# EAGLE board BMS Practice Board (EAGLE 9.2.2)
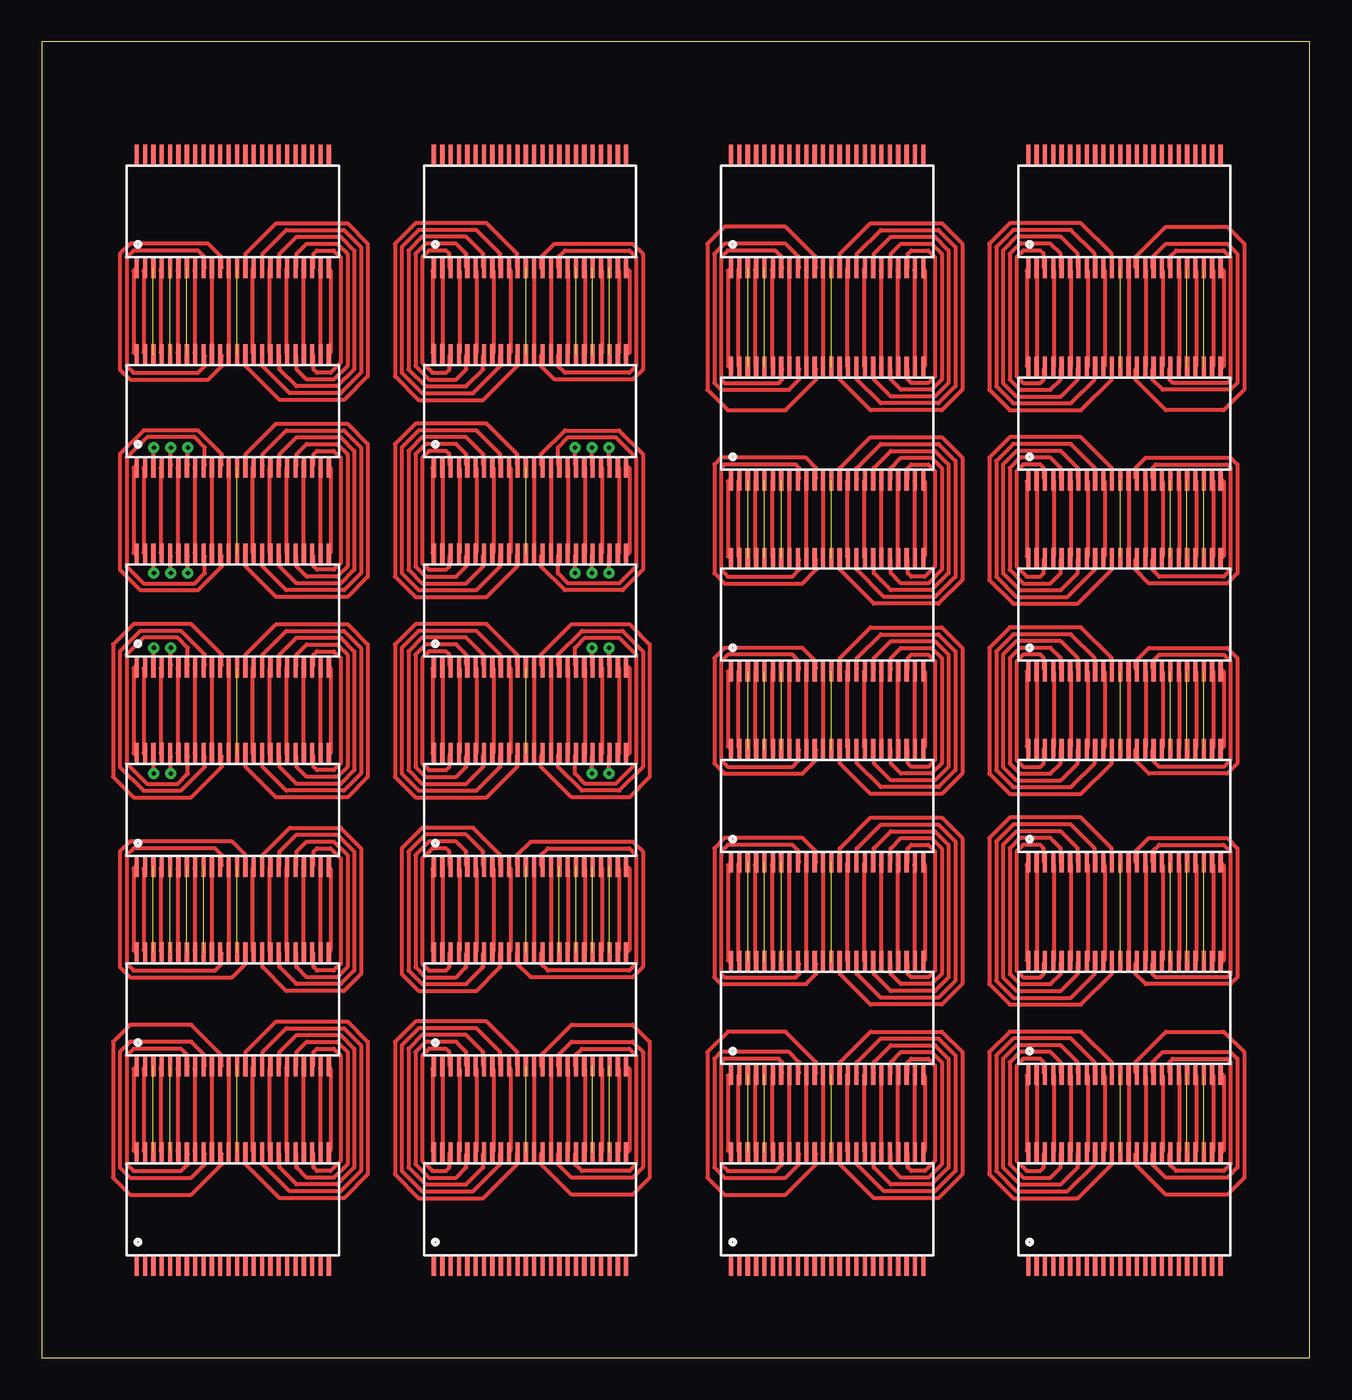
[diagram p1: board, top side]
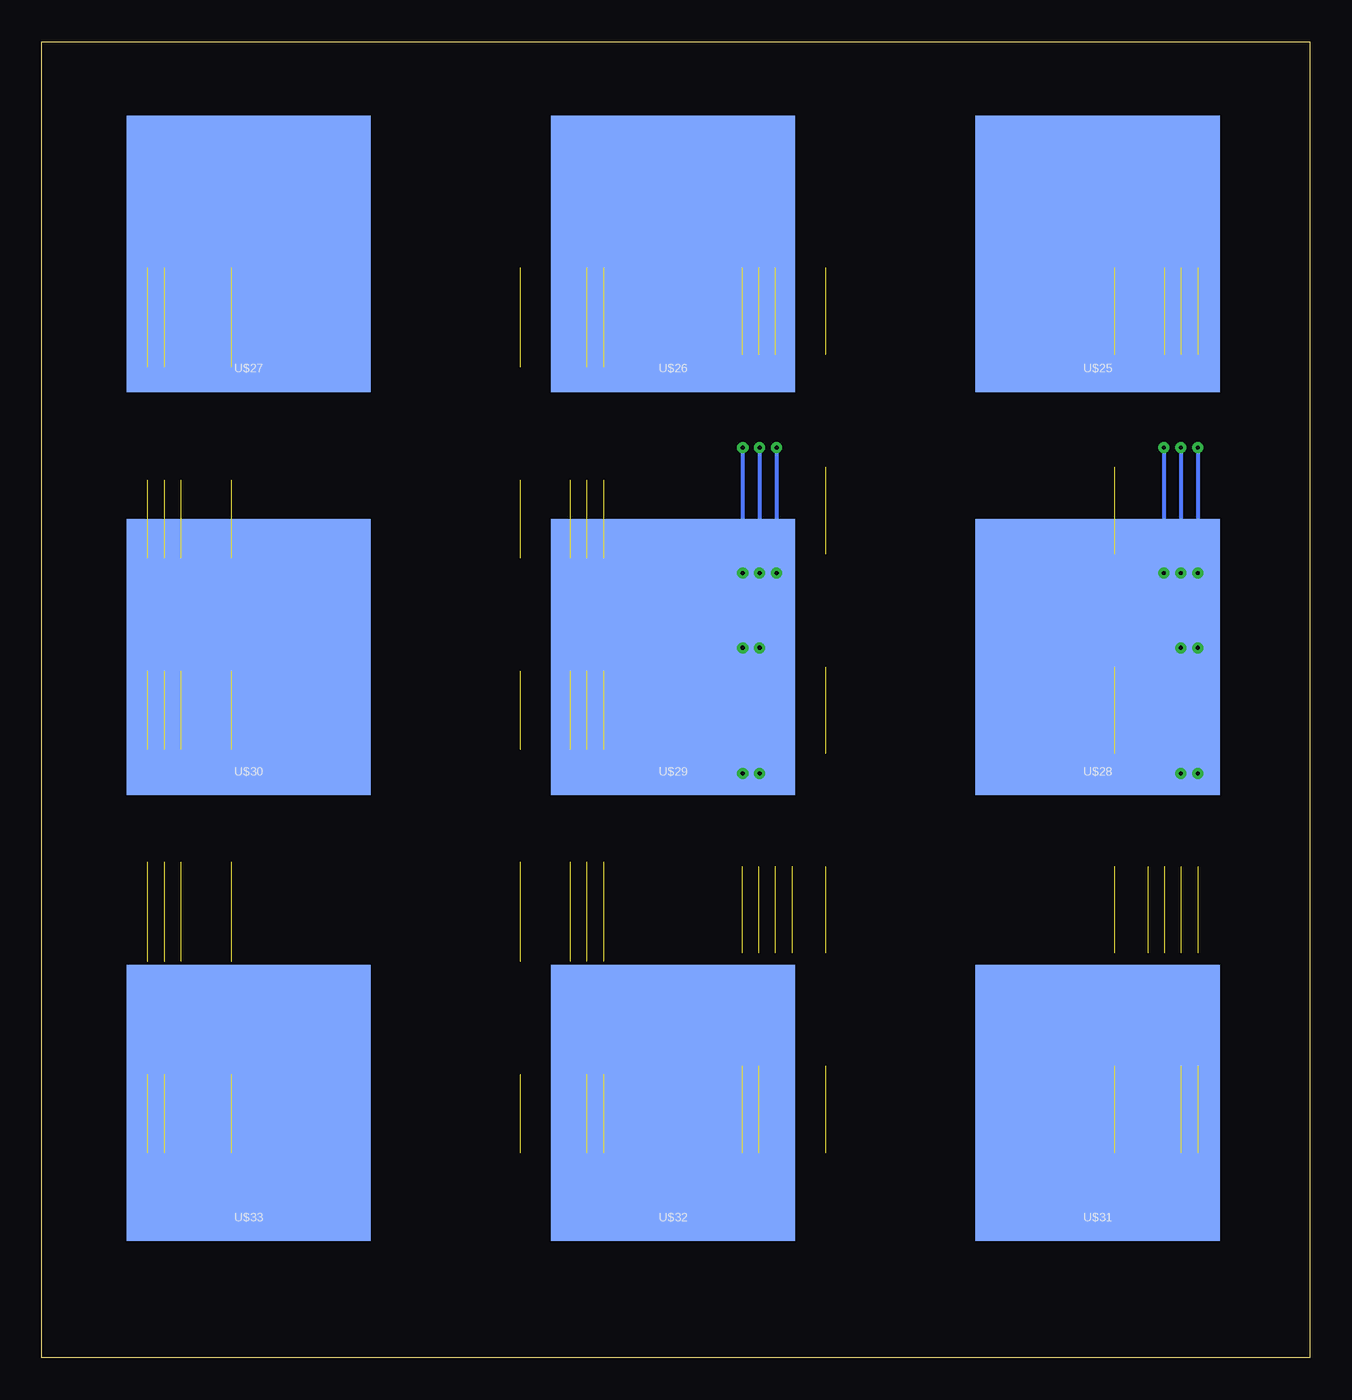
[diagram p2: board, bottom side, seen from below]

Size 75.87 x 78.73 mm. Coordinates in mm from the lower left corner, seen from the top.
Outline: 0,0 75.87,0 75.87,78.73 0,78.73 0,0
Copper layers (1*16): Top 0.035mm / dielectric 1.5mm / Bottom 0.035mm
Design rules "DRC Advanced Circuits": minimum track width 6mil, minimum drill 10mil, track to track 6mil, track to pad 6mil, pad to pad 6mil, via to via 6mil, smd to smd 6mil, copper to edge 40mil, drill to drill 6mil, minimum pad ring 10mil, minimum via ring 8mil, stop-mask expansion 4mil, vias tented up to drill 0mil, thermal gap 10mil
Net classes: 0 default: width 0.254 mm

## Footprints (pad centres in the part's own frame; a part is rotated, then mirrored left to right if it is on the bottom)
LTC6804 = smd 0.25 x 1.25: 1 -5.75,-3.37; 2 -5.25,-3.37; 3 -4.75,-3.37; 4 -4.25,-3.37; 5 -3.75,-3.37; 6 -3.25,-3.37; 7 -2.75,-3.37; 8 -2.25,-3.37; 9 -1.75,-3.37; 10 -1.25,-3.37; 11 -0.75,-3.37; 12 -0.25,-3.37; 13 0.25,-3.37; 14 0.75,-3.37; 15 1.25,-3.37; 16 1.75,-3.37; 17 2.25,-3.37; 18 2.75,-3.37; 19 3.25,-3.37; 20 3.75,-3.37; 21 4.25,-3.37; 22 4.75,-3.37; 23 5.25,-3.37; 24 5.75,-3.37; 25 5.75,3.38; 26 5.25,3.38; 27 4.75,3.38; 28 4.25,3.38; 29 3.75,3.38; 30 3.25,3.38; 31 2.75,3.38; 32 2.25,3.38; 33 1.75,3.38; 34 1.25,3.38; 35 0.75,3.38; 36 0.25,3.38; 37 -0.25,3.38; 38 -0.75,3.38; 39 -1.25,3.38; 40 -1.75,3.38; 41 -2.25,3.38; 42 -2.75,3.38; 43 -3.25,3.38; 44 -3.75,3.38; 45 -4.25,3.38; 46 -4.75,3.38; 47 -5.25,3.38; 48 -5.75,3.38
KEYSTONE5222 = smd 14.605 x 16.51: P$1 0,0

## Placement (x,y rotation side)
U$1  LTC6804-2  [LTC6804]  11.43,8.89 0 top
U$2  LTC6804-2  [LTC6804]  11.43,20.83 0 top
U$3  LTC6804-2  [LTC6804]  11.43,32.77 0 top
U$4  LTC6804-2  [LTC6804]  11.43,44.7 0 top
U$5  LTC6804-2  [LTC6804]  11.43,56.64 0 top
U$6  LTC6804-2  [LTC6804]  11.43,68.58 0 top
U$7  LTC6804-2  [LTC6804]  29.21,8.89 0 top
U$8  LTC6804-2  [LTC6804]  29.21,20.83 0 top
U$9  LTC6804-2  [LTC6804]  29.21,32.77 0 top
U$10  LTC6804-2  [LTC6804]  29.21,44.7 0 top
U$11  LTC6804-2  [LTC6804]  29.21,56.64 0 top
U$12  LTC6804-2  [LTC6804]  29.21,68.58 0 top
U$13  LTC6804-2  [LTC6804]  46.99,8.89 0 top
U$14  LTC6804-2  [LTC6804]  46.99,20.32 0 top
U$15  LTC6804-2  [LTC6804]  46.99,33.02 0 top
U$16  LTC6804-2  [LTC6804]  46.99,44.45 0 top
U$17  LTC6804-2  [LTC6804]  46.99,55.88 0 top
U$18  LTC6804-2  [LTC6804]  46.99,68.58 0 top
U$19  LTC6804-2  [LTC6804]  64.77,8.89 0 top
U$20  LTC6804-2  [LTC6804]  64.77,20.32 0 top
U$21  LTC6804-2  [LTC6804]  64.77,33.02 0 top
U$22  LTC6804-2  [LTC6804]  64.77,44.45 0 top
U$23  LTC6804-2  [LTC6804]  64.77,55.88 0 top
U$24  LTC6804-2  [LTC6804]  64.77,68.58 0 top
U$25  BATTERY_SPRING_KEYSTONE5222  [KEYSTONE5222]  12.7,66.04 0 bottom
U$26  BATTERY_SPRING_KEYSTONE5222  [KEYSTONE5222]  38.1,66.04 0 bottom
U$27  BATTERY_SPRING_KEYSTONE5222  [KEYSTONE5222]  63.5,66.04 0 bottom
U$28  BATTERY_SPRING_KEYSTONE5222  [KEYSTONE5222]  12.7,41.91 0 bottom
U$29  BATTERY_SPRING_KEYSTONE5222  [KEYSTONE5222]  38.1,41.91 0 bottom
U$30  BATTERY_SPRING_KEYSTONE5222  [KEYSTONE5222]  63.5,41.91 0 bottom
U$31  BATTERY_SPRING_KEYSTONE5222  [KEYSTONE5222]  12.7,15.24 0 bottom
U$32  BATTERY_SPRING_KEYSTONE5222  [KEYSTONE5222]  38.1,15.24 0 bottom
U$33  BATTERY_SPRING_KEYSTONE5222  [KEYSTONE5222]  63.5,15.24 0 bottom

## Tracks (layer width: path | path; a pad name or v marks a point on that pad's centre or on a via)
N$1
  Top 0.254: U$1.48 5.69,12.19 5.49,12.39 5.49,17.27 5.69,17.48 U$2.1
N$2
  Top 0.254: U$1.47 6.1,12.39 6.1,17.27 U$2.2
N$3  (1 unrouted)
N$4
  Top 0.254: U$1.45 7.11,12.39 7.11,17.27 U$2.4
N$5  (1 unrouted)
N$6
  Top 0.254: U$1.43 8.13,12.39 8.13,17.27 U$2.6
N$7
  Top 0.254: U$1.42 8.74,12.19 8.74,11.58 8.33,11.18 5.49,11.18 5.08,11.58 5.08,18.09 5.49,18.49 8.33,18.49 8.74,18.09 8.74,17.48 U$2.7
N$8
  Top 0.254: U$1.41 9.14,12.39 9.14,17.27 U$2.8
N$9
  Top 0.254: U$1.40 9.75,12.19 9.75,11.58 8.94,10.77 5.28,10.77 4.67,11.38 4.67,18.29 5.28,18.9 8.94,18.9 9.75,18.09 9.75,17.48 U$2.9
N$10
  Top 0.254: U$1.39 10.16,12.39 10.16,17.27 U$2.10
N$11
  Top 0.254: U$1.38 10.77,12.19 10.77,11.58 8.94,9.75 5.28,9.75 4.27,10.77 4.27,18.9 5.28,19.91 8.94,19.91 10.77,18.09 10.77,17.48 U$2.11
N$12
  Top 0.254: U$1.37 11.18,12.39 11.18,17.27 U$2.12
N$13  (1 unrouted)
N$14
  Top 0.254: U$1.35 12.19,12.19 12.19,11.58 14.22,9.55 18.09,9.55 19.51,10.97 19.51,18.9 18.29,20.12 14.02,20.12 12.19,18.29 12.19,17.48 U$2.14
N$15
  Top 0.254: U$1.34 12.6,12.39 12.6,17.27 U$2.15
N$16
  Top 0.254: U$1.33 13.21,12.19 13.21,11.58 14.83,9.96 17.88,9.96 19.1,11.18 19.1,18.69 18.09,19.71 14.63,19.71 13.21,18.29 13.21,17.48 U$2.16
N$17
  Top 0.254: U$1.32 13.61,12.39 13.61,17.27 U$2.17
N$18
  Top 0.254: U$1.31 14.22,12.19 14.22,11.38 15.24,10.36 17.68,10.36 18.69,11.38 18.69,18.49 17.88,19.3 15.24,19.3 14.22,18.29 14.22,17.48 U$2.18
N$19
  Top 0.254: U$1.30 14.63,12.39 14.63,17.27 U$2.19
N$20
  Top 0.254: U$1.29 15.24,12.19 15.24,11.38 15.85,10.77 17.48,10.77 18.29,11.58 18.29,18.29 17.68,18.9 15.85,18.9 15.24,18.29 15.24,17.48 U$2.20
N$21
  Top 0.254: U$1.28 15.65,12.39 15.65,17.27 U$2.21
N$22
  Top 0.254: U$1.27 16.26,12.19 16.26,11.38 16.46,11.18 17.27,11.18 17.88,11.79 17.88,18.09 17.48,18.49 16.46,18.49 16.26,18.29 16.26,17.48 U$2.22
N$23
  Top 0.254: U$1.26 16.66,12.39 16.66,17.27 U$2.23
N$24
  Top 0.254: U$1.25 17.27,12.39 17.27,17.27 U$2.24
N$25
  Top 0.254: U$2.48 5.69,24.18 5.49,24.38 5.49,29.26 5.69,29.46 U$3.1
N$26
  Top 0.254: U$2.47 6.1,24.38 6.1,29.26 U$3.2
N$27  (1 unrouted)
N$28
  Top 0.254: U$2.45 7.11,24.38 7.11,29.26 U$3.4
N$29  (1 unrouted)
N$30
  Top 0.254: U$2.43 8.13,24.38 8.13,29.26 U$3.6
N$31  (1 unrouted)
N$32
  Top 0.254: U$2.41 9.14,24.38 9.14,29.26 U$3.8
N$33  (1 unrouted)
N$34
  Top 0.254: U$2.39 10.16,24.38 10.16,29.26 U$3.10
N$35
  Top 0.254: U$2.38 10.77,24.18 10.77,23.57 10.36,23.16 5.49,23.16 5.08,23.57 5.08,30.07 5.49,30.48 10.36,30.48 10.77,30.07 10.77,29.46 U$3.11
N$36
  Top 0.254: U$2.37 11.18,24.38 11.18,29.26 U$3.12
N$37  (1 unrouted)
N$38
  Top 0.254: U$2.35 12.19,24.18 12.19,23.57 11.38,22.76 5.28,22.76 4.67,23.37 4.67,30.28 5.28,30.89 11.38,30.89 12.19,30.07 12.19,29.46 U$3.14
N$39
  Top 0.254: U$2.34 12.6,24.38 12.6,29.26 U$3.15
N$40
  Top 0.254: U$2.33 13.21,24.18 13.21,23.37 14.63,21.95 18.09,21.95 19.1,22.96 19.1,30.48 17.88,31.7 14.83,31.7 13.21,30.07 13.21,29.46 U$3.16
N$41
  Top 0.254: U$2.32 13.61,24.38 13.61,29.26 U$3.17
N$42
  Top 0.254: U$2.31 14.22,24.18 14.22,23.37 15.24,22.35 17.88,22.35 18.69,23.16 18.69,30.28 17.68,31.29 15.24,31.29 14.22,30.28 14.22,29.46 U$3.18
N$43
  Top 0.254: U$2.30 14.63,24.38 14.63,29.26 U$3.19
N$44
  Top 0.254: U$2.29 15.24,24.18 15.24,23.37 15.85,22.76 17.68,22.76 18.29,23.37 18.29,30.07 17.48,30.89 15.85,30.89 15.24,30.28 15.24,29.46 U$3.20
N$45
  Top 0.254: U$2.28 15.65,24.38 15.65,29.26 U$3.21
N$46
  Top 0.254: U$2.27 16.26,24.18 16.26,23.37 16.46,23.16 17.48,23.16 17.88,23.57 17.88,29.87 17.27,30.48 16.46,30.48 16.26,30.28 16.26,29.46 U$3.22
N$47
  Top 0.254: U$2.26 16.66,24.38 16.66,29.26 U$3.23
N$48
  Top 0.254: U$2.25 17.27,24.38 17.27,29.26 U$3.24
N$49
  Top 0.254: U$3.48 5.69,35.97 5.49,36.17 5.49,41.25 5.69,41.45 U$4.1
N$50
  Top 0.254: U$3.47 6.1,36.17 6.1,41.25 U$4.2
N$51  (via drill 0.25)
  Top 0.254: v6.71,34.95 6.71,35.97 U$3.46 | v6.71,42.47 6.71,41.45 U$4.3
  Bottom 0.254: v6.71,42.47 v6.71,34.95
N$52
  Top 0.254: U$3.45 7.11,36.17 7.11,41.25 U$4.4
N$53  (via drill 0.25)
  Top 0.254: v7.72,34.95 7.72,35.97 U$3.44 | v7.72,42.47 7.72,41.45 U$4.5
  Bottom 0.254: v7.72,42.47 v7.72,34.95
N$54
  Top 0.254: U$3.43 8.13,36.17 8.13,41.25 U$4.6
N$55
  Top 0.254: U$3.42 8.74,35.97 8.74,34.95 8.13,34.34 6.3,34.34 5.08,35.56 5.08,42.06 6.1,43.08 8.13,43.08 8.74,42.47 8.74,41.45 U$4.7
N$56
  Top 0.254: U$3.41 9.14,36.17 9.14,41.25 U$4.8
N$57
  Top 0.254: U$3.40 9.75,35.97 9.75,35.36 8.33,33.93 6.1,33.93 4.67,35.36 4.67,42.27 5.89,43.48 8.33,43.48 9.75,42.06 9.75,41.45 U$4.9
N$58
  Top 0.254: U$3.39 10.16,36.17 10.16,41.25 U$4.10
N$59
  Top 0.254: U$3.38 10.77,35.97 10.77,35.36 8.94,33.53 5.49,33.53 4.27,34.75 4.27,42.67 5.49,43.89 8.94,43.89 10.77,42.06 10.77,41.45 U$4.11
N$60
  Top 0.254: U$3.37 11.18,36.17 11.18,41.25 U$4.12
N$61  (1 unrouted)
N$62
  Top 0.254: U$3.35 12.19,35.97 12.19,35.36 14.02,33.53 18.29,33.53 19.51,34.75 19.51,42.67 18.29,43.89 14.02,43.89 12.19,42.06 12.19,41.45 U$4.14
N$63
  Top 0.254: U$3.34 12.6,36.17 12.6,41.25 U$4.15
N$64
  Top 0.254: U$3.33 13.21,35.97 13.21,35.36 14.63,33.93 18.09,33.93 19.1,34.95 19.1,42.47 18.09,43.48 14.63,43.48 13.21,42.06 13.21,41.45 U$4.16
N$65
  Top 0.254: U$3.32 13.61,36.17 13.61,41.25 U$4.17
N$66
  Top 0.254: U$3.31 14.22,35.97 14.22,35.36 15.24,34.34 17.88,34.34 18.69,35.15 18.69,42.27 17.88,43.08 15.24,43.08 14.22,42.06 14.22,41.45 U$4.18
N$67
  Top 0.254: U$3.30 14.63,36.17 14.63,41.25 U$4.19
N$68
  Top 0.254: U$3.29 15.24,35.97 15.24,35.36 15.85,34.75 17.68,34.75 18.29,35.36 18.29,42.06 17.68,42.67 15.85,42.67 15.24,42.06 15.24,41.45 U$4.20
N$69
  Top 0.254: U$3.28 15.65,36.17 15.65,41.25 U$4.21
N$70
  Top 0.254: U$3.27 16.26,35.97 16.26,35.36 16.46,35.15 17.48,35.15 17.88,35.56 17.88,41.86 17.48,42.27 16.46,42.27 16.26,42.06 16.26,41.45 U$4.22
N$71
  Top 0.254: U$3.26 16.66,36.17 16.66,41.25 U$4.23
N$72
  Top 0.254: U$3.25 17.27,36.17 17.27,41.25 U$4.24
N$73
  Top 0.254: U$4.48 5.69,47.95 5.49,48.16 5.49,53.24 5.69,53.44 U$5.1
N$74
  Top 0.254: U$4.47 6.1,48.16 6.1,53.24 U$5.2
N$75  (via drill 0.25)
  Top 0.254: v6.71,46.94 6.71,47.95 U$4.46 | v6.71,54.46 6.71,53.44 U$5.3
  Bottom 0.254: v6.71,54.46 v6.71,46.94
N$76
  Top 0.254: U$4.45 7.11,48.16 7.11,53.24 U$5.4
N$77  (via drill 0.25)
  Top 0.254: v7.72,46.94 7.72,47.95 U$4.44 | v7.72,54.46 7.72,53.44 U$5.5
  Bottom 0.254: v7.72,54.46 v7.72,46.94
N$78
  Top 0.254: U$4.43 8.13,48.16 8.13,53.24 U$5.6
N$79  (via drill 0.25)
  Top 0.254: v8.74,46.94 8.74,47.95 U$4.42 | v8.74,54.46 8.74,53.44 U$5.7
  Bottom 0.254: v8.74,54.46 v8.74,46.94
N$80
  Top 0.254: U$4.41 9.14,48.16 9.14,53.24 U$5.8
N$81
  Top 0.254: U$4.40 9.75,47.95 9.75,46.94 9.14,46.33 6.1,46.33 5.08,47.35 5.08,53.85 6.3,55.07 9.14,55.07 9.75,54.46 9.75,53.44 U$5.9
N$82
  Top 0.254: U$4.39 10.16,48.16 10.16,53.24 U$5.10
N$83
  Top 0.254: U$4.38 10.77,47.95 10.77,47.35 9.35,45.92 5.89,45.92 4.67,47.14 4.67,54.05 6.1,55.47 9.35,55.47 10.77,54.05 10.77,53.44 U$5.11
N$84
  Top 0.254: U$4.37 11.18,48.16 11.18,53.24 U$5.12
N$85  (1 unrouted)
N$86
  Top 0.254: U$4.35 12.19,47.95 12.19,47.35 14.02,45.52 18.29,45.52 19.51,46.74 19.51,54.66 18.29,55.88 14.02,55.88 12.19,54.05 12.19,53.44 U$5.14
N$87
  Top 0.254: U$4.34 12.6,48.16 12.6,53.24 U$5.15
N$88
  Top 0.254: U$4.33 13.21,47.95 13.21,47.35 14.63,45.92 18.09,45.92 19.1,46.94 19.1,54.46 18.09,55.47 14.63,55.47 13.21,54.05 13.21,53.44 U$5.16
N$89
  Top 0.254: U$4.32 13.61,48.16 13.61,53.24 U$5.17
N$90
  Top 0.254: U$4.31 14.22,47.95 14.22,47.35 15.24,46.33 17.88,46.33 18.69,47.14 18.69,54.25 17.88,55.07 15.24,55.07 14.22,54.05 14.22,53.44 U$5.18
N$91
  Top 0.254: U$4.30 14.63,48.16 14.63,53.24 U$5.19
N$92
  Top 0.254: U$4.29 15.24,47.95 15.24,47.35 15.85,46.74 17.68,46.74 18.29,47.35 18.29,54.05 17.68,54.66 15.85,54.66 15.24,54.05 15.24,53.44 U$5.20
N$93
  Top 0.254: U$4.28 15.65,48.16 15.65,53.24 U$5.21
N$94
  Top 0.254: U$4.27 16.26,47.95 16.26,47.35 16.46,47.14 17.48,47.14 17.88,47.55 17.88,53.85 17.48,54.25 16.46,54.25 16.26,54.05 16.26,53.44 U$5.22
N$95
  Top 0.254: U$4.26 16.66,48.16 16.66,53.24 U$5.23
N$96
  Top 0.254: U$4.25 17.27,48.16 17.27,53.24 U$5.24
N$97
  Top 0.254: U$5.48 5.69,59.94 5.49,60.15 5.49,65.02 5.69,65.23 U$6.1
N$98
  Top 0.254: U$5.47 6.1,60.15 6.1,65.02 U$6.2
N$99  (1 unrouted)
N$100
  Top 0.254: U$5.45 7.11,60.15 7.11,65.02 U$6.4
N$101  (1 unrouted)
N$102
  Top 0.254: U$5.43 8.13,60.15 8.13,65.02 U$6.6
N$103  (1 unrouted)
N$104
  Top 0.254: U$5.41 9.14,60.15 9.14,65.02 U$6.8
N$105
  Top 0.254: U$5.40 9.75,59.94 9.75,59.33 9.35,58.93 5.49,58.93 5.08,59.33 5.08,65.84 5.49,66.24 9.35,66.24 9.75,65.84 9.75,65.23 U$6.9
N$106
  Top 0.254: U$5.39 10.16,60.15 10.16,65.02 U$6.10
N$107
  Top 0.254: U$5.38 10.77,59.94 10.77,59.33 9.96,58.52 5.28,58.52 4.67,59.13 4.67,66.04 5.28,66.65 9.96,66.65 10.77,65.84 10.77,65.23 U$6.11
N$108
  Top 0.254: U$5.37 11.18,60.15 11.18,65.02 U$6.12
N$109  (1 unrouted)
N$110
  Top 0.254: U$5.35 12.19,59.94 12.19,59.33 14.22,57.3 18.09,57.3 19.51,58.73 19.51,66.65 18.29,67.87 14.02,67.87 12.19,66.04 12.19,65.23 U$6.14
N$111
  Top 0.254: U$5.34 12.6,60.15 12.6,65.02 U$6.15
N$112
  Top 0.254: U$5.33 13.21,59.94 13.21,59.33 14.83,57.71 17.88,57.71 19.1,58.93 19.1,66.45 18.09,67.46 14.63,67.46 13.21,66.04 13.21,65.23 U$6.16
N$113
  Top 0.254: U$5.32 13.61,60.15 13.61,65.02 U$6.17
N$114
  Top 0.254: U$5.31 14.22,59.94 14.22,59.13 15.24,58.12 17.68,58.12 18.69,59.13 18.69,66.24 17.88,67.06 15.24,67.06 14.22,66.04 14.22,65.23 U$6.18
N$115
  Top 0.254: U$5.30 14.63,60.15 14.63,65.02 U$6.19
N$116
  Top 0.254: U$5.29 15.24,59.94 15.24,59.13 15.85,58.52 17.48,58.52 18.29,59.33 18.29,66.04 17.68,66.65 15.85,66.65 15.24,66.04 15.24,65.23 U$6.20
N$117
  Top 0.254: U$5.28 15.65,60.15 15.65,65.02 U$6.21
N$118
  Top 0.254: U$5.27 16.26,59.94 16.26,59.13 16.46,58.93 17.27,58.93 17.88,59.54 17.88,65.84 17.48,66.24 16.46,66.24 16.26,66.04 16.26,65.23 U$6.22
N$119
  Top 0.254: U$5.26 16.66,60.15 16.66,65.02 U$6.23
N$120
  Top 0.254: U$5.25 17.27,60.15 17.27,65.02 U$6.24
N$121
  Top 0.254: U$7.25 34.95,12.19 35.15,12.39 35.15,17.27 34.95,17.48 U$8.24
N$122
  Top 0.254: U$7.26 34.54,12.39 34.54,17.27 U$8.23
N$123  (1 unrouted)
N$124
  Top 0.254: U$7.28 33.53,12.39 33.53,17.27 U$8.21
N$125  (1 unrouted)
N$126
  Top 0.254: U$7.30 32.51,12.39 32.51,17.27 U$8.19
N$127
  Top 0.254: U$7.31 31.9,12.19 31.9,11.58 32.31,11.18 35.15,11.18 35.56,11.58 35.56,18.09 35.15,18.49 32.31,18.49 31.9,18.09 31.9,17.48 U$8.18
N$128
  Top 0.254: U$7.32 31.5,12.39 31.5,17.27 U$8.17
N$129
  Top 0.254: U$7.33 30.89,12.19 30.89,11.58 31.7,10.77 35.36,10.77 35.97,11.38 35.97,18.29 35.36,18.9 31.7,18.9 30.89,18.09 30.89,17.48 U$8.16
N$130
  Top 0.254: U$7.34 30.48,12.39 30.48,17.27 U$8.15
N$131
  Top 0.254: U$7.35 29.87,12.19 29.87,11.58 31.7,9.75 35.36,9.75 36.37,10.77 36.37,18.9 35.36,19.91 31.7,19.91 29.87,18.09 29.87,17.48 U$8.14
N$132
  Top 0.254: U$7.36 29.46,12.39 29.46,17.27 U$8.13
N$133  (1 unrouted)
N$134
  Top 0.254: U$7.38 28.45,12.19 28.45,11.58 26.42,9.55 22.55,9.55 21.13,10.97 21.13,18.9 22.35,20.12 26.62,20.12 28.45,18.29 28.45,17.48 U$8.11
N$135
  Top 0.254: U$7.39 28.04,12.39 28.04,17.27 U$8.10
N$136
  Top 0.254: U$7.40 27.43,12.19 27.43,11.58 25.81,9.96 22.76,9.96 21.54,11.18 21.54,18.69 22.55,19.71 26.01,19.71 27.43,18.29 27.43,17.48 U$8.9
N$137
  Top 0.254: U$7.41 27.03,12.39 27.03,17.27 U$8.8
N$138
  Top 0.254: U$7.42 26.42,12.19 26.42,11.38 25.4,10.36 22.96,10.36 21.95,11.38 21.95,18.49 22.76,19.3 25.4,19.3 26.42,18.29 26.42,17.48 U$8.7
N$139
  Top 0.254: U$7.43 26.01,12.39 26.01,17.27 U$8.6
N$140
  Top 0.254: U$7.44 25.4,12.19 25.4,11.38 24.79,10.77 23.16,10.77 22.35,11.58 22.35,18.29 22.96,18.9 24.79,18.9 25.4,18.29 25.4,17.48 U$8.5
N$141
  Top 0.254: U$7.45 24.99,12.39 24.99,17.27 U$8.4
N$142
  Top 0.254: U$7.46 24.38,12.19 24.38,11.38 24.18,11.18 23.37,11.18 22.76,11.79 22.76,18.09 23.16,18.49 24.18,18.49 24.38,18.29 24.38,17.48 U$8.3
N$143
  Top 0.254: U$7.47 23.98,12.39 23.98,17.27 U$8.2
N$144
  Top 0.254: U$7.48 23.37,12.39 23.37,17.27 U$8.1
N$145
  Top 0.254: U$8.25 34.95,24.18 35.15,24.38 35.15,29.26 34.95,29.46 U$9.24
N$146
  Top 0.254: U$8.26 34.54,24.38 34.54,29.26 U$9.23
N$147  (1 unrouted)
N$148
  Top 0.254: U$8.28 33.53,24.38 33.53,29.26 U$9.21
N$149  (1 unrouted)
N$150
  Top 0.254: U$8.30 32.51,24.38 32.51,29.26 U$9.19
N$151  (1 unrouted)
N$152
  Top 0.254: U$8.32 31.5,24.38 31.5,29.26 U$9.17
N$153  (1 unrouted)
N$154
  Top 0.254: U$8.34 30.48,24.38 30.48,29.26 U$9.15
N$155
  Top 0.254: U$8.35 29.87,24.18 29.87,23.57 30.28,23.16 35.15,23.16 35.56,23.57 35.56,30.07 35.15,30.48 30.28,30.48 29.87,30.07 29.87,29.46 U$9.14
N$156
  Top 0.254: U$8.36 29.46,24.38 29.46,29.26 U$9.13
N$157  (1 unrouted)
N$158
  Top 0.254: U$8.38 28.45,24.18 28.45,23.57 29.26,22.76 35.36,22.76 35.97,23.37 35.97,30.28 35.36,30.89 29.26,30.89 28.45,30.07 28.45,29.46 U$9.11
N$159
  Top 0.254: U$8.39 28.04,24.38 28.04,29.26 U$9.10
N$160
  Top 0.254: U$8.40 27.43,24.18 27.43,23.37 26.01,21.95 22.55,21.95 21.54,22.96 21.54,30.48 22.76,31.7 25.81,31.7 27.43,30.07 27.43,29.46 U$9.9
N$161
  Top 0.254: U$8.41 27.03,24.38 27.03,29.26 U$9.8
N$162
  Top 0.254: U$8.42 26.42,24.18 26.42,23.37 25.4,22.35 22.76,22.35 21.95,23.16 21.95,30.28 22.96,31.29 25.4,31.29 26.42,30.28 26.42,29.46 U$9.7
N$163
  Top 0.254: U$8.43 26.01,24.38 26.01,29.26 U$9.6
N$164
  Top 0.254: U$8.44 25.4,24.18 25.4,23.37 24.79,22.76 22.96,22.76 22.35,23.37 22.35,30.07 23.16,30.89 24.79,30.89 25.4,30.28 25.4,29.46 U$9.5
N$165
  Top 0.254: U$8.45 24.99,24.38 24.99,29.26 U$9.4
N$166
  Top 0.254: U$8.46 24.38,24.18 24.38,23.37 24.18,23.16 23.16,23.16 22.76,23.57 22.76,29.87 23.37,30.48 24.18,30.48 24.38,30.28 24.38,29.46 U$9.3
N$167
  Top 0.254: U$8.47 23.98,24.38 23.98,29.26 U$9.2
N$168
  Top 0.254: U$8.48 23.37,24.38 23.37,29.26 U$9.1
N$169
  Top 0.254: U$9.25 34.95,35.97 35.15,36.17 35.15,41.25 34.95,41.45 U$10.24
N$170
  Top 0.254: U$9.26 34.54,36.17 34.54,41.25 U$10.23
N$171  (via drill 0.25)
  Top 0.254: v33.93,34.95 33.93,35.97 U$9.27 | v33.93,42.47 33.93,41.45 U$10.22
  Bottom 0.254: v33.93,42.47 v33.93,34.95
N$172
  Top 0.254: U$9.28 33.53,36.17 33.53,41.25 U$10.21
N$173  (via drill 0.25)
  Top 0.254: v32.92,34.95 32.92,35.97 U$9.29 | v32.92,42.47 32.92,41.45 U$10.20
  Bottom 0.254: v32.92,42.47 v32.92,34.95
N$174
  Top 0.254: U$9.30 32.51,36.17 32.51,41.25 U$10.19
N$175
  Top 0.254: U$9.31 31.9,35.97 31.9,34.95 32.51,34.34 34.34,34.34 35.56,35.56 35.56,42.06 34.54,43.08 32.51,43.08 31.9,42.47 31.9,41.45 U$10.18
N$176
  Top 0.254: U$9.32 31.5,36.17 31.5,41.25 U$10.17
N$177
  Top 0.254: U$9.33 30.89,35.97 30.89,35.36 32.31,33.93 34.54,33.93 35.97,35.36 35.97,42.27 34.75,43.48 32.31,43.48 30.89,42.06 30.89,41.45 U$10.16
N$178
  Top 0.254: U$9.34 30.48,36.17 30.48,41.25 U$10.15
N$179
  Top 0.254: U$9.35 29.87,35.97 29.87,35.36 31.7,33.53 35.15,33.53 36.37,34.75 36.37,42.67 35.15,43.89 31.7,43.89 29.87,42.06 29.87,41.45 U$10.14
N$180
  Top 0.254: U$9.36 29.46,36.17 29.46,41.25 U$10.13
N$181  (1 unrouted)
N$182
  Top 0.254: U$9.38 28.45,35.97 28.45,35.36 26.62,33.53 22.35,33.53 21.13,34.75 21.13,42.67 22.35,43.89 26.62,43.89 28.45,42.06 28.45,41.45 U$10.11
N$183
  Top 0.254: U$9.39 28.04,36.17 28.04,41.25 U$10.10
N$184
  Top 0.254: U$9.40 27.43,35.97 27.43,35.36 26.01,33.93 22.55,33.93 21.54,34.95 21.54,42.47 22.55,43.48 26.01,43.48 27.43,42.06 27.43,41.45 U$10.9
N$185
  Top 0.254: U$9.41 27.03,36.17 27.03,41.25 U$10.8
N$186
  Top 0.254: U$9.42 26.42,35.97 26.42,35.36 25.4,34.34 22.76,34.34 21.95,35.15 21.95,42.27 22.76,43.08 25.4,43.08 26.42,42.06 26.42,41.45 U$10.7
N$187
  Top 0.254: U$9.43 26.01,36.17 26.01,41.25 U$10.6
N$188
  Top 0.254: U$9.44 25.4,35.97 25.4,35.36 24.79,34.75 22.96,34.75 22.35,35.36 22.35,42.06 22.96,42.67 24.79,42.67 25.4,42.06 25.4,41.45 U$10.5
N$189
  Top 0.254: U$9.45 24.99,36.17 24.99,41.25 U$10.4
N$190
  Top 0.254: U$9.46 24.38,35.97 24.38,35.36 24.18,35.15 23.16,35.15 22.76,35.56 22.76,41.86 23.16,42.27 24.18,42.27 24.38,42.06 24.38,41.45 U$10.3
N$191
  Top 0.254: U$9.47 23.98,36.17 23.98,41.25 U$10.2
N$192
  Top 0.254: U$9.48 23.37,36.17 23.37,41.25 U$10.1
N$193
  Top 0.254: U$10.25 34.95,47.95 35.15,48.16 35.15,53.24 34.95,53.44 U$11.24
N$194
  Top 0.254: U$10.26 34.54,48.16 34.54,53.24 U$11.23
N$195  (via drill 0.25)
  Top 0.254: v33.93,46.94 33.93,47.95 U$10.27 | v33.93,54.46 33.93,53.44 U$11.22
  Bottom 0.254: v33.93,54.46 v33.93,46.94
N$196
  Top 0.254: U$10.28 33.53,48.16 33.53,53.24 U$11.21
N$197  (via drill 0.25)
  Top 0.254: v32.92,46.94 32.92,47.95 U$10.29 | v32.92,54.46 32.92,53.44 U$11.20
  Bottom 0.254: v32.92,54.46 v32.92,46.94
N$198
  Top 0.254: U$10.30 32.51,48.16 32.51,53.24 U$11.19
N$199  (via drill 0.25)
  Top 0.254: v31.9,46.94 31.9,47.95 U$10.31 | v31.9,54.46 31.9,53.44 U$11.18
  Bottom 0.254: v31.9,54.46 v31.9,46.94
N$200
  Top 0.254: U$10.32 31.5,48.16 31.5,53.24 U$11.17
N$201
  Top 0.254: U$10.33 30.89,47.95 30.89,46.94 31.5,46.33 34.54,46.33 35.56,47.35 35.56,53.85 34.34,55.07 31.5,55.07 30.89,54.46 30.89,53.44 U$11.16
N$202
  Top 0.254: U$10.34 30.48,48.16 30.48,53.24 U$11.15
N$203
  Top 0.254: U$10.35 29.87,47.95 29.87,47.35 31.29,45.92 34.75,45.92 35.97,47.14 35.97,54.05 34.54,55.47 31.29,55.47 29.87,54.05 29.87,53.44 U$11.14
N$204
  Top 0.254: U$10.36 29.46,48.16 29.46,53.24 U$11.13
N$205  (1 unrouted)
N$206
  Top 0.254: U$10.38 28.45,47.95 28.45,47.35 26.62,45.52 22.35,45.52 21.13,46.74 21.13,54.66 22.35,55.88 26.62,55.88 28.45,54.05 28.45,53.44 U$11.11
N$207
  Top 0.254: U$10.39 28.04,48.16 28.04,53.24 U$11.10
N$208
  Top 0.254: U$10.40 27.43,47.95 27.43,47.35 26.01,45.92 22.55,45.92 21.54,46.94 21.54,54.46 22.55,55.47 26.01,55.47 27.43,54.05 27.43,53.44 U$11.9
N$209
  Top 0.254: U$10.41 27.03,48.16 27.03,53.24 U$11.8
N$210
  Top 0.254: U$10.42 26.42,47.95 26.42,47.35 25.4,46.33 22.76,46.33 21.95,47.14 21.95,54.25 22.76,55.07 25.4,55.07 26.42,54.05 26.42,53.44 U$11.7
N$211
  Top 0.254: U$10.43 26.01,48.16 26.01,53.24 U$11.6
N$212
  Top 0.254: U$10.44 25.4,47.95 25.4,47.35 24.79,46.74 22.96,46.74 22.35,47.35 22.35,54.05 22.96,54.66 24.79,54.66 25.4,54.05 25.4,53.44 U$11.5
N$213
  Top 0.254: U$10.45 24.99,48.16 24.99,53.24 U$11.4
N$214
  Top 0.254: U$10.46 24.38,47.95 24.38,47.35 24.18,47.14 23.16,47.14 22.76,47.55 22.76,53.85 23.16,54.25 24.18,54.25 24.38,54.05 24.38,53.44 U$11.3
N$215
  Top 0.254: U$10.47 23.98,48.16 23.98,53.24 U$11.2
N$216
  Top 0.254: U$10.48 23.37,48.16 23.37,53.24 U$11.1
N$217
  Top 0.254: U$11.25 34.95,59.94 35.15,60.15 35.15,65.02 34.95,65.23 U$12.24
N$218
  Top 0.254: U$11.26 34.54,60.15 34.54,65.02 U$12.23
N$219  (1 unrouted)
N$220
  Top 0.254: U$11.28 33.53,60.15 33.53,65.02 U$12.21
N$221  (1 unrouted)
N$222
  Top 0.254: U$11.30 32.51,60.15 32.51,65.02 U$12.19
N$223  (1 unrouted)
N$224
  Top 0.254: U$11.32 31.5,60.15 31.5,65.02 U$12.17
N$225
  Top 0.254: U$11.33 30.89,59.94 30.89,59.33 31.29,58.93 35.15,58.93 35.56,59.33 35.56,65.84 35.15,66.24 31.29,66.24 30.89,65.84 30.89,65.23 U$12.16
N$226
  Top 0.254: U$11.34 30.48,60.15 30.48,65.02 U$12.15
N$227
  Top 0.254: U$11.35 29.87,59.94 29.87,59.33 30.68,58.52 35.36,58.52 35.97,59.13 35.97,66.04 35.36,66.65 30.68,66.65 29.87,65.84 29.87,65.23 U$12.14
N$228
  Top 0.254: U$11.36 29.46,60.15 29.46,65.02 U$12.13
N$229  (1 unrouted)
N$230
  Top 0.254: U$11.38 28.45,59.94 28.45,59.33 26.42,57.3 22.55,57.3 21.13,58.73 21.13,66.65 22.35,67.87 26.62,67.87 28.45,66.04 28.45,65.23 U$12.11
N$231
  Top 0.254: U$11.39 28.04,60.15 28.04,65.02 U$12.10
N$232
  Top 0.254: U$11.40 27.43,59.94 27.43,59.33 25.81,57.71 22.76,57.71 21.54,58.93 21.54,66.45 22.55,67.46 26.01,67.46 27.43,66.04 27.43,65.23 U$12.9
N$233
  Top 0.254: U$11.41 27.03,60.15 27.03,65.02 U$12.8
N$234
  Top 0.254: U$11.42 26.42,59.94 26.42,59.13 25.4,58.12 22.96,58.12 21.95,59.13 21.95,66.24 22.76,67.06 25.4,67.06 26.42,66.04 26.42,65.23 U$12.7
N$235
  Top 0.254: U$11.43 26.01,60.15 26.01,65.02 U$12.6
N$236
  Top 0.254: U$11.44 25.4,59.94 25.4,59.13 24.79,58.52 23.16,58.52 22.35,59.33 22.35,66.04 22.96,66.65 24.79,66.65 25.4,66.04 25.4,65.23 U$12.5
N$237
  Top 0.254: U$11.45 24.99,60.15 24.99,65.02 U$12.4
N$238
  Top 0.254: U$11.46 24.38,59.94 24.38,59.13 24.18,58.93 23.37,58.93 22.76,59.54 22.76,65.84 23.16,66.24 24.18,66.24 24.38,66.04 24.38,65.23 U$12.3
N$239
  Top 0.254: U$11.47 23.98,60.15 23.98,65.02 U$12.2
N$240
  Top 0.254: U$11.48 23.37,60.15 23.37,65.02 U$12.1
N$241
  Top 0.254: U$13.48 41.25,12.19 41.05,12.39 41.05,16.87 41.25,17.07 U$14.1
N$242
  Top 0.254: U$13.47 41.66,12.39 41.66,16.87 U$14.2
N$243  (1 unrouted)
N$244
  Top 0.254: U$13.45 42.67,12.39 42.67,16.87 U$14.4
N$245  (1 unrouted)
N$246
  Top 0.254: U$13.43 43.69,12.39 43.69,16.87 U$14.6
N$247
  Top 0.254: U$13.42 44.3,12.19 44.3,11.58 43.89,11.18 41.05,11.18 40.64,11.58 40.64,17.68 40.84,17.88 44.09,17.88 44.3,17.68 44.3,17.07 U$14.7
N$248
  Top 0.254: U$13.41 44.7,12.39 44.7,16.87 U$14.8
N$249
  Top 0.254: U$13.40 45.31,12.19 45.31,11.58 44.5,10.77 40.84,10.77 40.23,11.38 40.23,17.88 40.64,18.29 44.7,18.29 45.31,17.68 45.31,17.07 U$14.9
N$250
  Top 0.254: U$13.39 45.72,12.39 45.72,16.87 U$14.10
N$251
  Top 0.254: U$13.38 46.33,12.19 46.33,11.58 44.5,9.75 40.84,9.75 39.83,10.77 39.83,18.29 41.05,19.51 44.5,19.51 46.33,17.68 46.33,17.07 U$14.11
N$252
  Top 0.254: U$13.37 46.74,12.39 46.74,16.87 U$14.12
N$253  (1 unrouted)
N$254
  Top 0.254: U$13.35 47.75,12.19 47.75,11.58 49.78,9.55 53.65,9.55 55.07,10.97 55.07,18.29 53.85,19.51 49.58,19.51 47.75,17.68 47.75,17.07 U$14.14
N$255
  Top 0.254: U$13.34 48.16,12.39 48.16,16.87 U$14.15
N$256
  Top 0.254: U$13.33 48.77,12.19 48.77,11.58 50.39,9.96 53.44,9.96 54.66,11.18 54.66,18.09 53.65,19.1 50.19,19.1 48.77,17.68 48.77,17.07 U$14.16
N$257
  Top 0.254: U$13.32 49.17,12.39 49.17,16.87 U$14.17
N$258
  Top 0.254: U$13.31 49.78,12.19 49.78,11.38 50.8,10.36 53.24,10.36 54.25,11.38 54.25,17.88 53.44,18.69 50.8,18.69 49.78,17.68 49.78,17.07 U$14.18
N$259
  Top 0.254: U$13.30 50.19,12.39 50.19,16.87 U$14.19
N$260
  Top 0.254: U$13.29 50.8,12.19 50.8,11.38 51.41,10.77 53.03,10.77 53.85,11.58 53.85,17.68 53.24,18.29 51.41,18.29 50.8,17.68 50.8,17.07 U$14.20
N$261
  Top 0.254: U$13.28 51.21,12.39 51.21,16.87 U$14.21
N$262
  Top 0.254: U$13.27 51.82,12.19 51.82,11.38 52.02,11.18 52.83,11.18 53.44,11.79 53.44,17.48 53.03,17.88 52.02,17.88 51.82,17.68 51.82,17.07 U$14.22
N$263
  Top 0.254: U$13.26 52.22,12.39 52.22,16.87 U$14.23
N$264
  Top 0.254: U$13.25 52.83,12.39 52.83,16.87 U$14.24
N$265
  Top 0.254: U$14.48 41.25,23.57 41.05,23.77 41.05,29.46 41.25,29.67 U$15.1
N$266
  Top 0.254: U$14.47 41.66,23.77 41.66,29.46 U$15.2
N$267  (1 unrouted)
N$268
  Top 0.254: U$14.45 42.67,23.77 42.67,29.46 U$15.4
N$269  (1 unrouted)
N$270
  Top 0.254: U$14.43 43.69,23.77 43.69,29.46 U$15.6
N$271  (1 unrouted)
N$272
  Top 0.254: U$14.41 44.7,23.77 44.7,29.46 U$15.8
N$273
  Top 0.254: U$14.40 45.31,23.57 45.31,22.96 45.11,22.76 40.84,22.76 40.64,22.96 40.64,30.28 41.05,30.68 44.91,30.68 45.31,30.28 45.31,29.67 U$15.9
N$274
  Top 0.254: U$14.39 45.72,23.77 45.72,29.46 U$15.10
N$275
  Top 0.254: U$14.38 46.33,23.57 46.33,22.96 45.72,22.35 40.64,22.35 40.23,22.76 40.23,30.48 40.84,31.09 45.52,31.09 46.33,30.28 46.33,29.67 U$15.11
N$276
  Top 0.254: U$14.37 46.74,23.77 46.74,29.46 U$15.12
N$277  (1 unrouted)
N$278
  Top 0.254: U$14.35 47.75,23.57 47.75,22.96 49.58,21.13 53.85,21.13 55.07,22.35 55.07,31.09 53.85,32.31 49.58,32.31 47.75,30.48 47.75,29.67 U$15.14
N$279
  Top 0.254: U$14.34 48.16,23.77 48.16,29.46 U$15.15
N$280
  Top 0.254: U$14.33 48.77,23.57 48.77,22.96 50.19,21.54 53.65,21.54 54.66,22.55 54.66,30.89 53.65,31.9 50.19,31.9 48.77,30.48 48.77,29.67 U$15.16
N$281
  Top 0.254: U$14.32 49.17,23.77 49.17,29.46 U$15.17
N$282
  Top 0.254: U$14.31 49.78,23.57 49.78,22.96 50.8,21.95 53.44,21.95 54.25,22.76 54.25,30.68 53.44,31.5 50.8,31.5 49.78,30.48 49.78,29.67 U$15.18
N$283
  Top 0.254: U$14.30 50.19,23.77 50.19,29.46 U$15.19
N$284
  Top 0.254: U$14.29 50.8,23.57 50.8,22.96 51.41,22.35 53.24,22.35 53.85,22.96 53.85,30.48 53.24,31.09 51.41,31.09 50.8,30.48 50.8,29.67 U$15.20
N$285
  Top 0.254: U$14.28 51.21,23.77 51.21,29.46 U$15.21
N$286
  Top 0.254: U$14.27 51.82,23.57 51.82,22.96 52.02,22.76 53.03,22.76 53.44,23.16 53.44,30.28 53.03,30.68 52.02,30.68 51.82,30.48 51.82,29.67 U$15.22
N$287
  Top 0.254: U$14.26 52.22,23.77 52.22,29.46 U$15.23
N$288
  Top 0.254: U$14.25 52.83,23.77 52.83,29.46 U$15.24
N$289
  Top 0.254: U$15.48 41.25,36.37 41.05,36.58 41.05,41.05 41.25,41.25 U$16.1
N$290
  Top 0.254: U$15.47 41.66,36.58 41.66,41.05 U$16.2
N$291  (1 unrouted)
N$292
  Top 0.254: U$15.45 42.67,36.58 42.67,41.05 U$16.4
N$293  (1 unrouted)
N$294
  Top 0.254: U$15.43 43.69,36.58 43.69,41.05 U$16.6
N$295  (1 unrouted)
N$296
  Top 0.254: U$15.41 44.7,36.58 44.7,41.05 U$16.8
N$297
  Top 0.254: U$15.40 45.31,36.37 45.31,35.76 44.91,35.36 41.05,35.36 40.64,35.76 40.64,41.66 41.05,42.06 44.91,42.06 45.31,41.66 45.31,41.25 U$16.9
N$298
  Top 0.254: U$15.39 45.72,36.58 45.72,41.05 U$16.10
N$299
  Top 0.254: U$15.38 46.33,36.37 46.33,35.76 45.52,34.95 40.84,34.95 40.23,35.56 40.23,41.86 40.84,42.47 45.52,42.47 46.33,41.66 46.33,41.25 U$16.11
N$300
  Top 0.254: U$15.37 46.74,36.58 46.74,41.05 U$16.12
N$301  (1 unrouted)
N$302
  Top 0.254: U$15.35 47.75,36.37 47.75,35.56 49.58,33.73 53.85,33.73 55.07,34.95 55.07,42.47 53.85,43.69 49.58,43.69 47.75,41.86 47.75,41.25 U$16.14
N$303
  Top 0.254: U$15.34 48.16,36.58 48.16,41.05 U$16.15
N$304
  Top 0.254: U$15.33 48.77,36.37 48.77,35.56 50.19,34.14 53.65,34.14 54.66,35.15 54.66,42.27 53.65,43.28 50.19,43.28 48.77,41.86 48.77,41.25 U$16.16
N$305
  Top 0.254: U$15.32 49.17,36.58 49.17,41.05 U$16.17
N$306
  Top 0.254: U$15.31 49.78,36.37 49.78,35.56 50.8,34.54 53.44,34.54 54.25,35.36 54.25,42.06 53.44,42.88 50.8,42.88 49.78,41.86 49.78,41.25 U$16.18
N$307
  Top 0.254: U$15.30 50.19,36.58 50.19,41.05 U$16.19
N$308
  Top 0.254: U$15.29 50.8,36.37 50.8,35.56 51.41,34.95 53.24,34.95 53.85,35.56 53.85,41.86 53.24,42.47 51.41,42.47 50.8,41.86 50.8,41.25 U$16.20
N$309
  Top 0.254: U$15.28 51.21,36.58 51.21,41.05 U$16.21
N$310
  Top 0.254: U$15.27 51.82,36.37 51.82,35.56 52.02,35.36 53.03,35.36 53.44,35.76 53.44,41.66 53.03,42.06 52.02,42.06 51.82,41.86 51.82,41.25 U$16.22
N$311
  Top 0.254: U$15.26 52.22,36.58 52.22,41.05 U$16.23
N$312
  Top 0.254: U$15.25 52.83,36.58 52.83,41.05 U$16.24
N$313
  Top 0.254: U$16.48 41.25,47.75 41.05,47.95 41.05,52.43 41.25,52.63 U$17.1
N$314
  Top 0.254: U$16.47 41.66,47.95 41.66,52.43 U$17.2
N$315  (1 unrouted)
N$316
  Top 0.254: U$16.45 42.67,47.95 42.67,52.43 U$17.4
N$317  (1 unrouted)
N$318
  Top 0.254: U$16.43 43.69,47.95 43.69,52.43 U$17.6
N$319  (1 unrouted)
N$320
  Top 0.254: U$16.41 44.7,47.95 44.7,52.43 U$17.8
N$321
  Top 0.254: U$16.40 45.31,47.75 45.31,47.14 44.91,46.74 41.05,46.74 40.64,47.14 40.64,53.24 40.84,53.44 45.11,53.44 45.31,53.24 45.31,52.63 U$17.9
N$322
  Top 0.254: U$16.39 45.72,47.95 45.72,52.43 U$17.10
N$323
  Top 0.254: U$16.38 46.33,47.75 46.33,47.14 45.52,46.33 40.84,46.33 40.23,46.94 40.23,53.44 40.64,53.85 45.72,53.85 46.33,53.24 46.33,52.63 U$17.11
N$324
  Top 0.254: U$16.37 46.74,47.95 46.74,52.43 U$17.12
N$325  (1 unrouted)
N$326
  Top 0.254: U$16.35 47.75,47.75 47.75,47.14 49.78,45.11 53.65,45.11 55.07,46.53 55.07,53.85 53.85,55.07 49.58,55.07 47.75,53.24 47.75,52.63 U$17.14
N$327
  Top 0.254: U$16.34 48.16,47.95 48.16,52.43 U$17.15
N$328
  Top 0.254: U$16.33 48.77,47.75 48.77,47.14 50.39,45.52 53.44,45.52 54.66,46.74 54.66,53.65 53.65,54.66 50.19,54.66 48.77,53.24 48.77,52.63 U$17.16
N$329
  Top 0.254: U$16.32 49.17,47.95 49.17,52.43 U$17.17
N$330
  Top 0.254: U$16.31 49.78,47.75 49.78,46.94 50.8,45.92 53.24,45.92 54.25,46.94 54.25,53.44 53.44,54.25 50.8,54.25 49.78,53.24 49.78,52.63 U$17.18
N$331
  Top 0.254: U$16.30 50.19,47.95 50.19,52.43 U$17.19
N$332
  Top 0.254: U$16.29 50.8,47.75 50.8,46.94 51.41,46.33 53.03,46.33 53.85,47.14 53.85,53.24 53.24,53.85 51.41,53.85 50.8,53.24 50.8,52.63 U$17.20
N$333
  Top 0.254: U$16.28 51.21,47.95 51.21,52.43 U$17.21
N$334
  Top 0.254: U$16.27 51.82,47.75 51.82,46.94 52.02,46.74 52.83,46.74 53.44,47.35 53.44,53.03 53.03,53.44 52.02,53.44 51.82,53.24 51.82,52.63 U$17.22
N$335
  Top 0.254: U$16.26 52.22,47.95 52.22,52.43 U$17.23
N$336
  Top 0.254: U$16.25 52.83,47.95 52.83,52.43 U$17.24
N$337
  Top 0.254: U$17.48 41.25,59.13 41.05,59.33 41.05,65.02 41.25,65.23 U$18.1
N$338
  Top 0.254: U$17.47 41.66,59.33 41.66,65.02 U$18.2
N$339  (1 unrouted)
N$340
  Top 0.254: U$17.45 42.67,59.33 42.67,65.02 U$18.4
N$341  (1 unrouted)
N$342
  Top 0.254: U$17.43 43.69,59.33 43.69,65.02 U$18.6
N$343
  Top 0.254: U$17.42 44.3,59.13 44.3,58.52 44.09,58.32 40.84,58.32 40.64,58.52 40.64,65.84 41.05,66.24 43.89,66.24 44.3,65.84 44.3,65.23 U$18.7
N$344
  Top 0.254: U$17.41 44.7,59.33 44.7,65.02 U$18.8
N$345
  Top 0.254: U$17.40 45.31,59.13 45.31,58.52 44.7,57.91 40.64,57.91 40.23,58.32 40.23,66.04 40.84,66.65 44.5,66.65 45.31,65.84 45.31,65.23 U$18.9
N$346
  Top 0.254: U$17.39 45.72,59.33 45.72,65.02 U$18.10
N$347
  Top 0.254: U$17.38 46.33,59.13 46.33,58.52 44.5,56.69 41.05,56.69 39.83,57.91 39.83,66.65 40.84,67.67 44.5,67.67 46.33,65.84 46.33,65.23 U$18.11
N$348
  Top 0.254: U$17.37 46.74,59.33 46.74,65.02 U$18.12
N$349  (1 unrouted)
N$350
  Top 0.254: U$17.35 47.75,59.13 47.75,58.52 49.58,56.69 53.85,56.69 55.07,57.91 55.07,66.65 53.85,67.87 49.58,67.87 47.75,66.04 47.75,65.23 U$18.14
N$351
  Top 0.254: U$17.34 48.16,59.33 48.16,65.02 U$18.15
N$352
  Top 0.254: U$17.33 48.77,59.13 48.77,58.52 50.19,57.1 53.65,57.1 54.66,58.12 54.66,66.45 53.65,67.46 50.19,67.46 48.77,66.04 48.77,65.23 U$18.16
N$353
  Top 0.254: U$17.32 49.17,59.33 49.17,65.02 U$18.17
N$354
  Top 0.254: U$17.31 49.78,59.13 49.78,58.52 50.8,57.51 53.44,57.51 54.25,58.32 54.25,66.24 53.44,67.06 50.8,67.06 49.78,66.04 49.78,65.23 U$18.18
N$355
  Top 0.254: U$17.30 50.19,59.33 50.19,65.02 U$18.19
N$356
  Top 0.254: U$17.29 50.8,59.13 50.8,58.52 51.41,57.91 53.24,57.91 53.85,58.52 53.85,66.04 53.24,66.65 51.41,66.65 50.8,66.04 50.8,65.23 U$18.20
N$357
  Top 0.254: U$17.28 51.21,59.33 51.21,65.02 U$18.21
N$358
  Top 0.254: U$17.27 51.82,59.13 51.82,58.52 52.02,58.32 53.03,58.32 53.44,58.73 53.44,65.84 53.03,66.24 52.02,66.24 51.82,66.04 51.82,65.23 U$18.22
N$359
  Top 0.254: U$17.26 52.22,59.33 52.22,65.02 U$18.23
N$360
  Top 0.254: U$17.25 52.83,59.33 52.83,65.02 U$18.24
N$361
  Top 0.254: U$19.25 70.51,12.19 70.71,12.39 70.71,16.87 70.51,17.07 U$20.24
N$362
  Top 0.254: U$19.26 70.1,12.39 70.1,16.87 U$20.23
N$363  (1 unrouted)
N$364
  Top 0.254: U$19.28 69.09,12.39 69.09,16.87 U$20.21
N$365  (1 unrouted)
N$366
  Top 0.254: U$19.30 68.07,12.39 68.07,16.87 U$20.19
N$367
  Top 0.254: U$19.31 67.46,12.19 67.46,11.58 67.87,11.18 70.71,11.18 71.12,11.58 71.12,17.68 70.92,17.88 67.67,17.88 67.46,17.68 67.46,17.07 U$20.18
N$368
  Top 0.254: U$19.32 67.06,12.39 67.06,16.87 U$20.17
N$369
  Top 0.254: U$19.33 66.45,12.19 66.45,11.58 67.26,10.77 70.92,10.77 71.53,11.38 71.53,17.88 71.12,18.29 67.06,18.29 66.45,17.68 66.45,17.07 U$20.16
N$370
  Top 0.254: U$19.34 66.04,12.39 66.04,16.87 U$20.15
N$371
  Top 0.254: U$19.35 65.43,12.19 65.43,11.58 67.26,9.75 70.92,9.75 71.93,10.77 71.93,18.29 70.71,19.51 67.26,19.51 65.43,17.68 65.43,17.07 U$20.14
N$372
  Top 0.254: U$19.36 65.02,12.39 65.02,16.87 U$20.13
N$373  (1 unrouted)
N$374
  Top 0.254: U$19.38 64.01,12.19 64.01,11.58 61.98,9.55 58.12,9.55 56.69,10.97 56.69,18.29 57.91,19.51 62.18,19.51 64.01,17.68 64.01,17.07 U$20.11
N$375
  Top 0.254: U$19.39 63.6,12.39 63.6,16.87 U$20.10
N$376
  Top 0.254: U$19.40 62.99,12.19 62.99,11.58 61.37,9.96 58.32,9.96 57.1,11.18 57.1,18.09 58.12,19.1 61.57,19.1 62.99,17.68 62.99,17.07 U$20.9
N$377
  Top 0.254: U$19.41 62.59,12.39 62.59,16.87 U$20.8
N$378
  Top 0.254: U$19.42 61.98,12.19 61.98,11.38 60.96,10.36 58.52,10.36 57.51,11.38 57.51,17.88 58.32,18.69 60.96,18.69 61.98,17.68 61.98,17.07 U$20.7
N$379
  Top 0.254: U$19.43 61.57,12.39 61.57,16.87 U$20.6
N$380
  Top 0.254: U$19.44 60.96,12.19 60.96,11.38 60.35,10.77 58.73,10.77 57.91,11.58 57.91,17.68 58.52,18.29 60.35,18.29 60.96,17.68 60.96,17.07 U$20.5
N$381
  Top 0.254: U$19.45 60.55,12.39 60.55,16.87 U$20.4
N$382
  Top 0.254: U$19.46 59.94,12.19 59.94,11.38 59.74,11.18 58.93,11.18 58.32,11.79 58.32,17.48 58.73,17.88 59.74,17.88 59.94,17.68 59.94,17.07 U$20.3
N$383
  Top 0.254: U$19.47 59.54,12.39 59.54,16.87 U$20.2
N$384
  Top 0.254: U$19.48 58.93,12.39 58.93,16.87 U$20.1
N$385
  Top 0.254: U$20.25 70.51,23.57 70.71,23.77 70.71,29.46 70.51,29.67 U$21.24
N$386
  Top 0.254: U$20.26 70.1,23.77 70.1,29.46 U$21.23
N$387  (1 unrouted)
N$388
  Top 0.254: U$20.28 69.09,23.77 69.09,29.46 U$21.21
N$389  (1 unrouted)
N$390
  Top 0.254: U$20.30 68.07,23.77 68.07,29.46 U$21.19
N$391  (1 unrouted)
N$392
  Top 0.254: U$20.32 67.06,23.77 67.06,29.46 U$21.17
N$393
  Top 0.254: U$20.33 66.45,23.57 66.45,22.96 66.65,22.76 70.92,22.76 71.12,22.96 71.12,30.28 70.71,30.68 66.85,30.68 66.45,30.28 66.45,29.67 U$21.16
N$394
  Top 0.254: U$20.34 66.04,23.77 66.04,29.46 U$21.15
N$395
  Top 0.254: U$20.35 65.43,23.57 65.43,22.96 66.04,22.35 71.12,22.35 71.53,22.76 71.53,30.48 70.92,31.09 66.24,31.09 65.43,30.28 65.43,29.67 U$21.14
N$396
  Top 0.254: U$20.36 65.02,23.77 65.02,29.46 U$21.13
N$397  (1 unrouted)
N$398
  Top 0.254: U$20.38 64.01,23.57 64.01,22.96 62.18,21.13 57.91,21.13 56.69,22.35 56.69,31.09 57.91,32.31 62.18,32.31 64.01,30.48 64.01,29.67 U$21.11
N$399
  Top 0.254: U$20.39 63.6,23.77 63.6,29.46 U$21.10
N$400
  Top 0.254: U$20.40 62.99,23.57 62.99,22.96 61.57,21.54 58.12,21.54 57.1,22.55 57.1,30.89 58.12,31.9 61.57,31.9 62.99,30.48 62.99,29.67 U$21.9
N$401
  Top 0.254: U$20.41 62.59,23.77 62.59,29.46 U$21.8
N$402
  Top 0.254: U$20.42 61.98,23.57 61.98,22.96 60.96,21.95 58.32,21.95 57.51,22.76 57.51,30.68 58.32,31.5 60.96,31.5 61.98,30.48 61.98,29.67 U$21.7
N$403
  Top 0.254: U$20.43 61.57,23.77 61.57,29.46 U$21.6
N$404
  Top 0.254: U$20.44 60.96,23.57 60.96,22.96 60.35,22.35 58.52,22.35 57.91,22.96 57.91,30.48 58.52,31.09 60.35,31.09 60.96,30.48 60.96,29.67 U$21.5
N$405
  Top 0.254: U$20.45 60.55,23.77 60.55,29.46 U$21.4
N$406
  Top 0.254: U$20.46 59.94,23.57 59.94,22.96 59.74,22.76 58.73,22.76 58.32,23.16 58.32,30.28 58.73,30.68 59.74,30.68 59.94,30.48 59.94,29.67 U$21.3
N$407
  Top 0.254: U$20.47 59.54,23.77 59.54,29.46 U$21.2
N$408
  Top 0.254: U$20.48 58.93,23.77 58.93,29.46 U$21.1
N$409
  Top 0.254: U$21.25 70.51,36.37 70.71,36.58 70.71,41.05 70.51,41.25 U$22.24
N$410
  Top 0.254: U$21.26 70.1,36.58 70.1,41.05 U$22.23
N$411  (1 unrouted)
N$412
  Top 0.254: U$21.28 69.09,36.58 69.09,41.05 U$22.21
N$413  (1 unrouted)
N$414
  Top 0.254: U$21.30 68.07,36.58 68.07,41.05 U$22.19
N$415  (1 unrouted)
N$416
  Top 0.254: U$21.32 67.06,36.58 67.06,41.05 U$22.17
N$417
  Top 0.254: U$21.33 66.45,36.37 66.45,35.76 66.85,35.36 70.71,35.36 71.12,35.76 71.12,41.66 70.71,42.06 66.85,42.06 66.45,41.66 66.45,41.25 U$22.16
N$418
  Top 0.254: U$21.34 66.04,36.58 66.04,41.05 U$22.15
N$419
  Top 0.254: U$21.35 65.43,36.37 65.43,35.76 66.24,34.95 70.92,34.95 71.53,35.56 71.53,41.86 70.92,42.47 66.24,42.47 65.43,41.66 65.43,41.25 U$22.14
N$420
  Top 0.254: U$21.36 65.02,36.58 65.02,41.05 U$22.13
N$421  (1 unrouted)
N$422
  Top 0.254: U$21.38 64.01,36.37 64.01,35.56 62.18,33.73 57.91,33.73 56.69,34.95 56.69,42.47 57.91,43.69 62.18,43.69 64.01,41.86 64.01,41.25 U$22.11
N$423
  Top 0.254: U$21.39 63.6,36.58 63.6,41.05 U$22.10
N$424
  Top 0.254: U$21.40 62.99,36.37 62.99,35.56 61.57,34.14 58.12,34.14 57.1,35.15 57.1,42.27 58.12,43.28 61.57,43.28 62.99,41.86 62.99,41.25 U$22.9
N$425
  Top 0.254: U$21.41 62.59,36.58 62.59,41.05 U$22.8
N$426
  Top 0.254: U$21.42 61.98,36.37 61.98,35.56 60.96,34.54 58.32,34.54 57.51,35.36 57.51,42.06 58.32,42.88 60.96,42.88 61.98,41.86 61.98,41.25 U$22.7
N$427
  Top 0.254: U$21.43 61.57,36.58 61.57,41.05 U$22.6
N$428
  Top 0.254: U$21.44 60.96,36.37 60.96,35.56 60.35,34.95 58.52,34.95 57.91,35.56 57.91,41.86 58.52,42.47 60.35,42.47 60.96,41.86 60.96,41.25 U$22.5
N$429
  Top 0.254: U$21.45 60.55,36.58 60.55,41.05 U$22.4
N$430
  Top 0.254: U$21.46 59.94,36.37 59.94,35.56 59.74,35.36 58.73,35.36 58.32,35.76 58.32,41.66 58.73,42.06 59.74,42.06 59.94,41.86 59.94,41.25 U$22.3
N$431
  Top 0.254: U$21.47 59.54,36.58 59.54,41.05 U$22.2
N$432
  Top 0.254: U$21.48 58.93,36.58 58.93,41.05 U$22.1
N$433
  Top 0.254: U$22.25 70.51,47.75 70.71,47.95 70.71,52.43 70.51,52.63 U$23.24
N$434
  Top 0.254: U$22.26 70.1,47.95 70.1,52.43 U$23.23
N$435  (1 unrouted)
N$436
  Top 0.254: U$22.28 69.09,47.95 69.09,52.43 U$23.21
N$437  (1 unrouted)
N$438
  Top 0.254: U$22.30 68.07,47.95 68.07,52.43 U$23.19
N$439  (1 unrouted)
N$440
  Top 0.254: U$22.32 67.06,47.95 67.06,52.43 U$23.17
N$441
  Top 0.254: U$22.33 66.45,47.75 66.45,47.14 66.85,46.74 70.71,46.74 71.12,47.14 71.12,53.24 70.92,53.44 66.65,53.44 66.45,53.24 66.45,52.63 U$23.16
N$442
  Top 0.254: U$22.34 66.04,47.95 66.04,52.43 U$23.15
N$443
  Top 0.254: U$22.35 65.43,47.75 65.43,47.14 66.24,46.33 70.92,46.33 71.53,46.94 71.53,53.44 71.12,53.85 66.04,53.85 65.43,53.24 65.43,52.63 U$23.14
N$444
  Top 0.254: U$22.36 65.02,47.95 65.02,52.43 U$23.13
N$445  (1 unrouted)
N$446
  Top 0.254: U$22.38 64.01,47.75 64.01,47.14 61.98,45.11 58.12,45.11 56.69,46.53 56.69,53.85 57.91,55.07 62.18,55.07 64.01,53.24 64.01,52.63 U$23.11
N$447
  Top 0.254: U$22.39 63.6,47.95 63.6,52.43 U$23.10
N$448
  Top 0.254: U$22.40 62.99,47.75 62.99,47.14 61.37,45.52 58.32,45.52 57.1,46.74 57.1,53.65 58.12,54.66 61.57,54.66 62.99,53.24 62.99,52.63 U$23.9
N$449
  Top 0.254: U$22.41 62.59,47.95 62.59,52.43 U$23.8
N$450
  Top 0.254: U$22.42 61.98,47.75 61.98,46.94 60.96,45.92 58.52,45.92 57.51,46.94 57.51,53.44 58.32,54.25 60.96,54.25 61.98,53.24 61.98,52.63 U$23.7
N$451
  Top 0.254: U$22.43 61.57,47.95 61.57,52.43 U$23.6
N$452
  Top 0.254: U$22.44 60.96,47.75 60.96,46.94 60.35,46.33 58.73,46.33 57.91,47.14 57.91,53.24 58.52,53.85 60.35,53.85 60.96,53.24 60.96,52.63 U$23.5
N$453
  Top 0.254: U$22.45 60.55,47.95 60.55,52.43 U$23.4
N$454
  Top 0.254: U$22.46 59.94,47.75 59.94,46.94 59.74,46.74 58.93,46.74 58.32,47.35 58.32,53.03 58.73,53.44 59.74,53.44 59.94,53.24 59.94,52.63 U$23.3
N$455
  Top 0.254: U$22.47 59.54,47.95 59.54,52.43 U$23.2
N$456
  Top 0.254: U$22.48 58.93,47.95 58.93,52.43 U$23.1
N$457
  Top 0.254: U$23.25 70.51,59.13 70.71,59.33 70.71,65.02 70.51,65.23 U$24.24
N$458
  Top 0.254: U$23.26 70.1,59.33 70.1,65.02 U$24.23
N$459  (1 unrouted)
N$460
  Top 0.254: U$23.28 69.09,59.33 69.09,65.02 U$24.21
N$461  (1 unrouted)
N$462
  Top 0.254: U$23.30 68.07,59.33 68.07,65.02 U$24.19
N$463
  Top 0.254: U$23.31 67.46,59.13 67.46,58.52 67.67,58.32 70.92,58.32 71.12,58.52 71.12,65.84 70.71,66.24 67.87,66.24 67.46,65.84 67.46,65.23 U$24.18
N$464
  Top 0.254: U$23.32 67.06,59.33 67.06,65.02 U$24.17
N$465
  Top 0.254: U$23.33 66.45,59.13 66.45,58.52 67.06,57.91 71.12,57.91 71.53,58.32 71.53,66.04 70.92,66.65 67.26,66.65 66.45,65.84 66.45,65.23 U$24.16
N$466
  Top 0.254: U$23.34 66.04,59.33 66.04,65.02 U$24.15
N$467
  Top 0.254: U$23.35 65.43,59.13 65.43,58.52 67.26,56.69 70.71,56.69 71.93,57.91 71.93,66.65 70.92,67.67 67.26,67.67 65.43,65.84 65.43,65.23 U$24.14
N$468
  Top 0.254: U$23.36 65.02,59.33 65.02,65.02 U$24.13
N$469  (1 unrouted)
N$470
  Top 0.254: U$23.38 64.01,59.13 64.01,58.52 62.18,56.69 57.91,56.69 56.69,57.91 56.69,66.65 57.91,67.87 62.18,67.87 64.01,66.04 64.01,65.23 U$24.11
N$471
  Top 0.254: U$23.39 63.6,59.33 63.6,65.02 U$24.10
N$472
  Top 0.254: U$23.40 62.99,59.13 62.99,58.52 61.57,57.1 58.12,57.1 57.1,58.12 57.1,66.45 58.12,67.46 61.57,67.46 62.99,66.04 62.99,65.23 U$24.9
N$473
  Top 0.254: U$23.41 62.59,59.33 62.59,65.02 U$24.8
N$474
  Top 0.254: U$23.42 61.98,59.13 61.98,58.52 60.96,57.51 58.32,57.51 57.51,58.32 57.51,66.24 58.32,67.06 60.96,67.06 61.98,66.04 61.98,65.23 U$24.7
N$475
  Top 0.254: U$23.43 61.57,59.33 61.57,65.02 U$24.6
N$476
  Top 0.254: U$23.44 60.96,59.13 60.96,58.52 60.35,57.91 58.52,57.91 57.91,58.52 57.91,66.04 58.52,66.65 60.35,66.65 60.96,66.04 60.96,65.23 U$24.5
N$477
  Top 0.254: U$23.45 60.55,59.33 60.55,65.02 U$24.4
N$478
  Top 0.254: U$23.46 59.94,59.13 59.94,58.52 59.74,58.32 58.73,58.32 58.32,58.73 58.32,65.84 58.73,66.24 59.74,66.24 59.94,66.04 59.94,65.23 U$24.3
N$479
  Top 0.254: U$23.47 59.54,59.33 59.54,65.02 U$24.2
N$480
  Top 0.254: U$23.48 58.93,59.33 58.93,65.02 U$24.1

## Text on the board
tDocu: HyTech Racing 2019 BMS Practice Board